# Altium schematic sheet RTD_v1_schem.SchDoc
size A; SheetNumber: 1; SheetTotal: 1
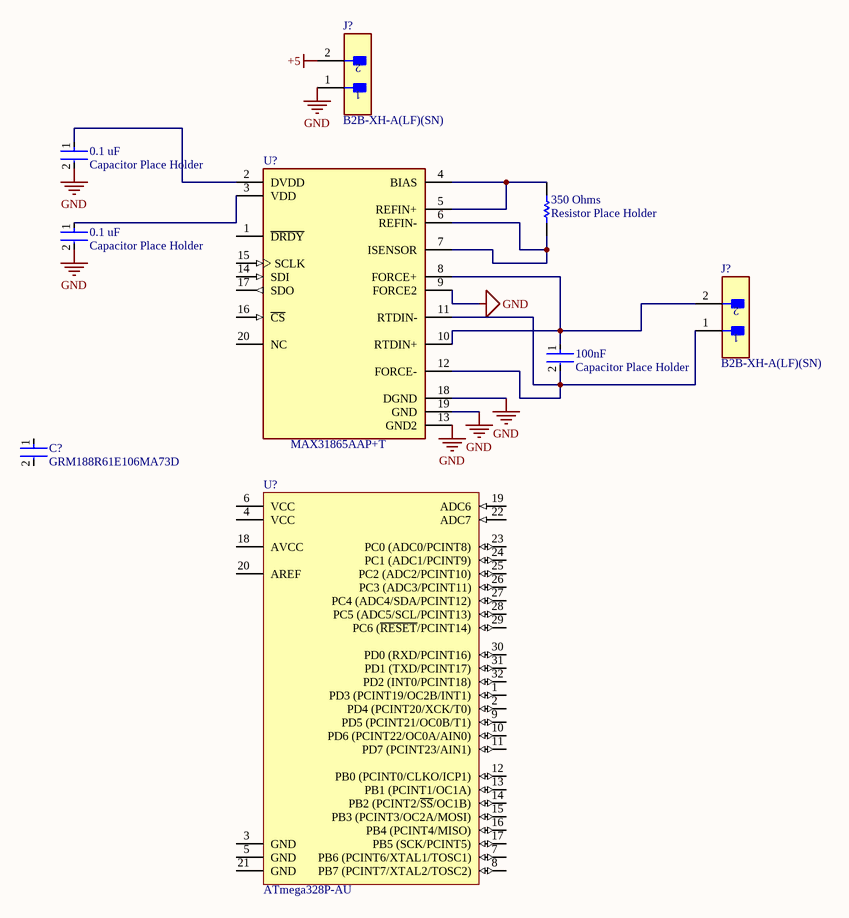
[diagram p0: RTD_v1_schem.SchDoc]

## Parts
(Parts that share a designator on the sheet are numbered #1, #2 ... from top to bottom, then left to right.)
0.1_uF#1  Capacitor Place Holder  [FP-C0402-BB-MFG]
0.1_uF#2  Capacitor Place Holder  [FP-C0402-BB-MFG]
100nF  Capacitor Place Holder  [FP-C0402-BB-MFG]
350_Ohms  Resistor Place Holder  [RESC1609X50X30NL8T20]
C?  GRM188R61E106MA73D  [FP-GRM188-0_2-MFG]
J?#1  B2B-XH-A(LF)(SN)  [FP-B2B-XH-A_LF_SN-MFG]
J?#2  B2B-XH-A(LF)(SN)  [FP-B2B-XH-A_LF_SN-MFG]
U?#1  MAX31865AAP+T  [FP-A20-1-MFG]
U?#2  ATmega328P-AU  [32A_M]

## Nets
+5: J?#1.2
GND: 0.1_uF#1.2 0.1_uF#2.2 J?#1.1 U?#1.9(FORCE2) U?#1.13(GND2) U?#1.18(DGND) U?#1.19(GND)
Net0.1_uF#1_1: 0.1_uF#1.1 U?#1.2(DVDD)
Net0.1_uF#2_1: 0.1_uF#2.1 U?#1.3(VDD)
Net100nF_1: 100nF.1 J?#2.2 U?#1.8(FORCE+) U?#1.10(RTDIN+)
Net100nF_2: 100nF.2 J?#2.1 U?#1.11(RTDIN-) U?#1.12(FORCE-)
Net350_Ohms_1: 350_Ohms.1 U?#1.6(REFIN-) U?#1.7(ISENSOR)
Net350_Ohms_2: 350_Ohms.2 U?#1.4(BIAS) U?#1.5(REFIN+)

Not connected (* = marked no-connect by the designer): C? 1 2; U?#1 1(~{DRDY}) 14(SDI) 15(SCLK) 16(~{CS}) 17(SDO) 20(NC); U?#2 1(PD3_(PCINT19/OC2B/INT1)) 2(PD4_(PCINT20/XCK/T0)) 3(GND) 4(VCC) 5(GND) 6(VCC) 7(PB6_(PCINT6/XTAL1/TOSC1)) 8(PB7_(PCINT7/XTAL2/TOSC2)) 9(PD5_(PCINT21/OC0B/T1)) 10(PD6_(PCINT22/OC0A/AIN0)) 11(PD7_(PCINT23/AIN1)) 12(PB0_(PCINT0/CLKO/ICP1)) 13(PB1_(PCINT1/OC1A)) 14(PB2_(PCINT2/~{SS}/OC1B)) 15(PB3_(PCINT3/OC2A/MOSI)) 16(PB4_(PCINT4/MISO)) 17(PB5_(SCK/PCINT5)) 18(AVCC) 19(ADC6) 20(AREF) 21(GND) 22(ADC7) 23(PC0_(ADC0/PCINT8)) 24(PC1_(ADC1/PCINT9)) 25(PC2_(ADC2/PCINT10)) 26(PC3_(ADC3/PCINT11)) 27(PC4_(ADC4/SDA/PCINT12)) 28(PC5_(ADC5/SCL/PCINT13)) 29(PC6_(~{RESET}/PCINT14)) 30(PD0_(RXD/PCINT16)) 31(PD1_(TXD/PCINT17)) 32(PD2_(INT0/PCINT18))

## Library data of the parts
0.1_uF#1 0.1_uF#2 100nF = CMP-2008-02046-2: CAP CER 0.1UF 10V X5R 0402; Manufacturer: Kemet; Manufacturer Part Number: C0402C104K8PACTU; Capacitance: 0.10 μF; Temperature Coefficient: 15%; Tolerance: 0.1; Value: 0.10 μF; Material: Ceramic; Package: C0402-BB; Temperature: -55°C to +125°C; ComponentLink2Description: Datasheet; Temperature Characteristic: X5R; Device Class L1: Passive Components; Height: 0.55mm; Lead Free: Yes; ComponentLink2URL: https://content.kemet.com/datasheets/KEM_C1002_X7R_SMD.pdf; Device Class L2: Capacitors; Temperature Range Low: -55°C; Temperature Range High: +125°C; RoHS: TRUE; Octopart: https://octopart.com/c0402c104k8pactu-kemet-140039; Automotive: No; Mouser Description: Capacitor 100 nF 10 VDC 0402; Category: Cap; Voltage Rating: 10 V; Digikey Description: CAP CER 0.1UF 10V X5R 0402; Ipc Land Pattern Name: CAPC10050X50; Device Class L3: Ceramic Capacitors
350_Ohms = CMP-2000-03816-5: Chip Resistor, 0 Ohm, Jumper, 100 mW, -55 to 155 degC, 0603 (1608 Metric), RoHS, Tape and Reel; Manufacturer: Vishay Semiconductor; Voltage Rating: 75 V; Package Quantity: 5000; DatasheetVersion: 06/2012; Min Operating Temperature: -55 degC; ComponentLink1URL: http://www.vishay.com/; Mounting Technology: Surface Mount; Height: 0.45 mm; ComponentLink1Description: Manufacturer URL; REACH SVHC: Unknown; PackageReference: 0603; Packaging: Tape and Reel; Max Operating Temperature: 155 degC; Mount: Surface Mount; ComponentLink2Description: Datasheet; PackageDescription: 2-Pin Surface Mount Device, Body 1.575 x 0.85 mm; Length: 1.55 mm; ComponentLink2URL: http://www.vishay.com/docs/20035/dcrcwe3.pdf; Pins: 2; RoHSCompliant: true
C? = CMP-2006-02520-2: Chip Multilayer Ceramic Capacitors for General Purpose, 0603, 10uF, X5R, 15%, 20%, 25V; Tolerance: 20%; Resistor Type: Ceramic; Voltage: 25V; Max Operating Temperature: 85°C; Min Operating Temperature: -55°C; Capacitance: 10uF; Dielectric: X5R; Lead Free: Lead Free; REACH SVHC: No SVHC; Case/Package: 0603; Mount: Surface Mount; Voltage Rating (DC): 25V; Height: 0.8mm; Length: 1.6mm; Thickness: 0.031inch; Width: 0.031inch; Termination: SMD/SMT; Case Code (Imperial): 0603; Case Code (Metric): 1608; Package Quantity: 1; Packaging: Tape and Reel; Depth: 0.8mm; Voltage Rating: 25V; Weight: 0.000222oz; Number of Pins: 2
J?#1 J?#2 = CMP-2000-05888-3: CONN HEADER VERT 2POS 2.5MM; Current Rating: 3A; Voltage Rating: 250V; Number of Contacts: 2; Contact Resistance: 20mR; Wire/Cable Gauge: 22AWG; Insulation Resistance: 1GR; Connector Type: Male Pin; Packaging: Bulk; Contact Material: Brass; Lead Free: Lead Free; Orientation: Straight; Contact Plating: Tin; Max Current Rating: 3A; Termination: Solder; Fastening Type: Detent; Depth: 5.75mm; Housing Material: Polyamide; REACH SVHC: No SVHC; Series: XH; Voltage Rating (AC): 250V; Number of Positions: 2; Color: Natural; Contact Type: Male Pin; Max Voltage Rating (DC): 250V; Pitch: 2.5mm; Lead Pitch: 2.5mm; Mount: Through Hole; Max Operating Temperature: 85°C; Length: 7.4mm; Max Voltage Rating (AC): 250V; Min Operating Temperature: -25°C; Number of Rows: 1; Housing Color: White
U?#1 = CMP-05687-000005-1: IC RTD TO DIGITAL CONVERT 20SSOP; Output Type: SPI; Min Operating Temperature: -40°C; Packaging: Tape and Reel; Mount: Surface Mount; Case/Package: SSOP; Max Operating Temperature: 125°C
U?#2 = CMP-0095-00269-2: 8-bit AVR Microcontroller, 32KB Flash, 1KB EEPROM, 2KB SRAM, 32-pin TQFP, Industrial Grade (-40°C to 85°C); PackageDescription: 32-Lead, 7x7x1.0 mm Body, 0.8mm Lead Pitch, Thin Profile Plastic Quad Flat Package (TQFP); DatasheetVersion: revD, May-2011; RevisionNote: DatasheetVersion & PackageVersion updated. URLs added.; ComponentLink1URL: http://www.atmel.com/; ComponentLink2Description: ATmega48A/48PA/88A/88PA/168A/168PA/328/328P Datasheet; Code_JEDEC: MS-026-ABA; ComponentLink1Description: Manufacturer URL; PackageReference: 32A; ComponentLink3Description: ATmega48A/48PA/88A/88PA/168A/168PA/328/328P Summary; ComponentLink2URL: http://www.atmel.com/dyn/resources/prod_documents/doc8271.pdf; PackageVersion: revC, Oct-2010; ComponentLink3URL: http://www.atmel.com/dyn/resources/prod_documents/8271S.pdf